# Altium schematic sheet CAN.SchDoc
size A
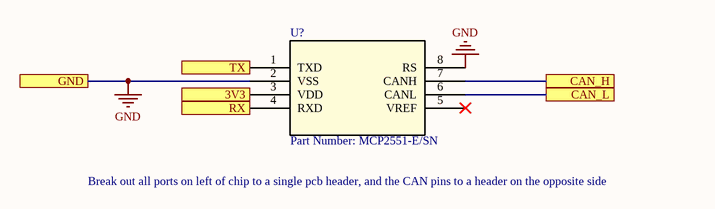
[diagram p0: CAN.SchDoc]

## Parts
U?  Part Number: MCP2551-E/SN  [SOIC8-N_MC]

## Ports
3V3, CAN_H, CAN_L, GND, RX, TX

## Nets
GND: U?.2(VSS) U?.8(RS) ; port GND
3V3: U?.3(VDD) ; port 3V3
CAN_H: U?.7(CANH) ; port CAN_H
CAN_L: U?.6(CANL) ; port CAN_L
RX: U?.4(RXD) ; port RX
TX: U?.1(TXD) ; port TX

Not connected (* = marked no-connect by the designer): U? 5(VREF)*

## Notes on the sheet
- Break out all ports on left of chip to a single pcb header, and the CAN pins to a header on the opposite side

## Library data of the parts
U? = MCP2551-E/SN: No Description Available; Vendor: Microchip; Built_By: EMA_Jessica; Manufacturer_Part_Number: MCP2551-E/SN; Copyright: Copyright (C) 2018 Accelerated Designs. All rights reserved; RefDes: RefDes; Type: DEV; Value: Value